# Altium schematic sheet CBU模块转8266封装.SchDoc
size A4
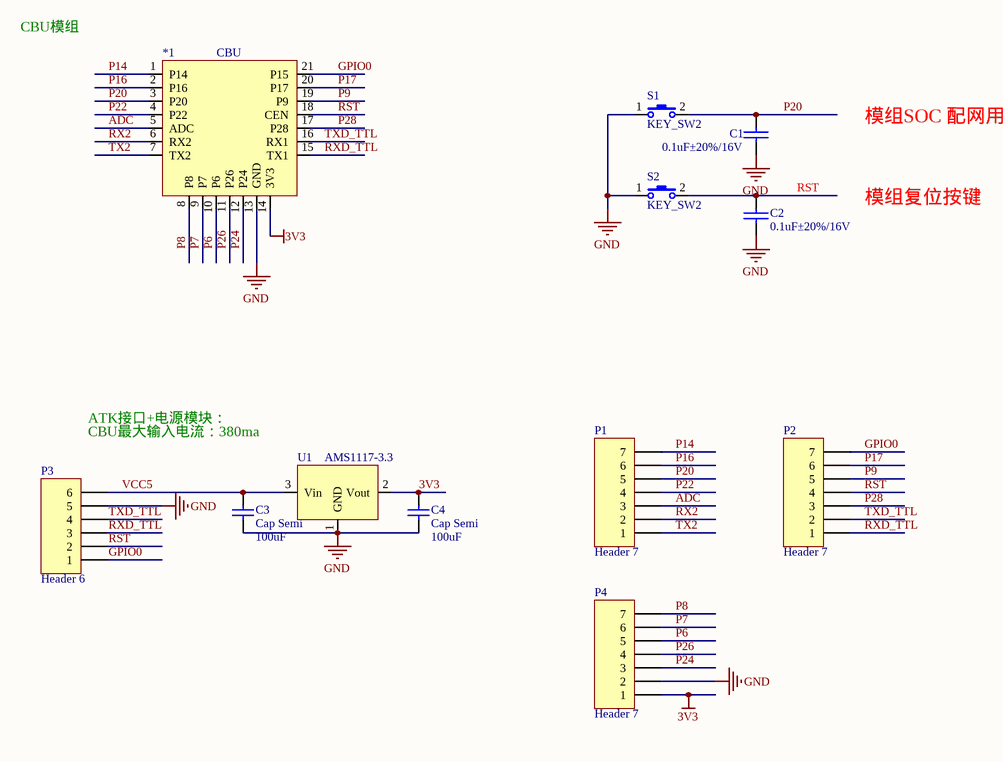
[diagram p0: CBU模块转8266封装.SchDoc]

## Parts
*1  CBU
C1  0.1uF±20%/16V  [C0603]
C2  0.1uF±20%/16V  [C0603]
C3  Cap Semi  value 100uF  [0402]
C4  Cap Semi  value 100uF  [0402]
P1  Header 7  [HDR1X7]
P2  Header 7  [HDR1X7]
P3  Header 6  [HDR1X6]
P4  Header 7  [HDR1X7]
S1  KEY_SW2  [KEY4-SMD]
S2  KEY_SW2  [KEY4-SMD]
U1  AMS1117-3.3  [SOT89]

## Nets
3V3: *1.14(3V3) C4.2 P4.1 U1.2(Vout)
GND: *1.13(GND) C1.1 C2.2 C3.1 C4.1 P3.5 P4.2 S1.1 S2.1 U1.1(GND)
ADC: *1.5(ADC) P1.3
GPIO0: *1.21(P15) P2.7 P3.1
P6: *1.10(P6) P4.5
P7: *1.9(P7) P4.6
P8: *1.8(P8) P4.7
P9: *1.19(P9) P2.5
P14: *1.1(P14) P1.7
P16: *1.2(P16) P1.6
P17: *1.20(P17) P2.6
P20: *1.3(P20) C1.2 P1.5 S1.2
P22: *1.4(P22) P1.4
P24: *1.12(P24) P4.3
P26: *1.11(P26) P4.4
P28: *1.17(P28) P2.3
RST: *1.18(CEN) C2.1 P2.4 P3.2 S2.2
RX2: *1.6(RX2) P1.2
RXD_TTL: *1.15(TX1) P2.1 P3.3
TX2: *1.7(TX2) P1.1
TXD_TTL: *1.16(RX1) P2.2 P3.4
VCC5: C3.2 P3.6 U1.3(Vin)

## Notes on the sheet
- CBU模组
- 模组SOC 配网用按键
- 模组复位按键
- ATK接口+电源模块：
- CBU最大输入电流：380ma

## Library data of the parts
C1 C2 = CAP: Capacitor
C3 C4 = Cap Semi: Capacitor (Semiconductor SIM Model); Published: 8-Jun-2000; LatestRevisionDate: 29-May-2009; LatestRevisionNote: IPC-7351 Footprint Added.; PackageReference: C1206; Publisher: Altium Limited; PackageDescription: Chip Capacitor
P1 P2 P4 = Header 7: Header, 7-Pin; LatestRevisionDate: 17-Jul-2002; LatestRevisionNote: Re-released for DXP Platform.; Publisher: Altium Limited
P3 = Header 6: Header, 6-Pin; LatestRevisionDate: 17-Jul-2002; LatestRevisionNote: Re-released for DXP Platform.; Publisher: Altium Limited
U1 = AMS1117